# EAGLE schematic SWD_OptoIsolator (EAGLE 7.7.0)
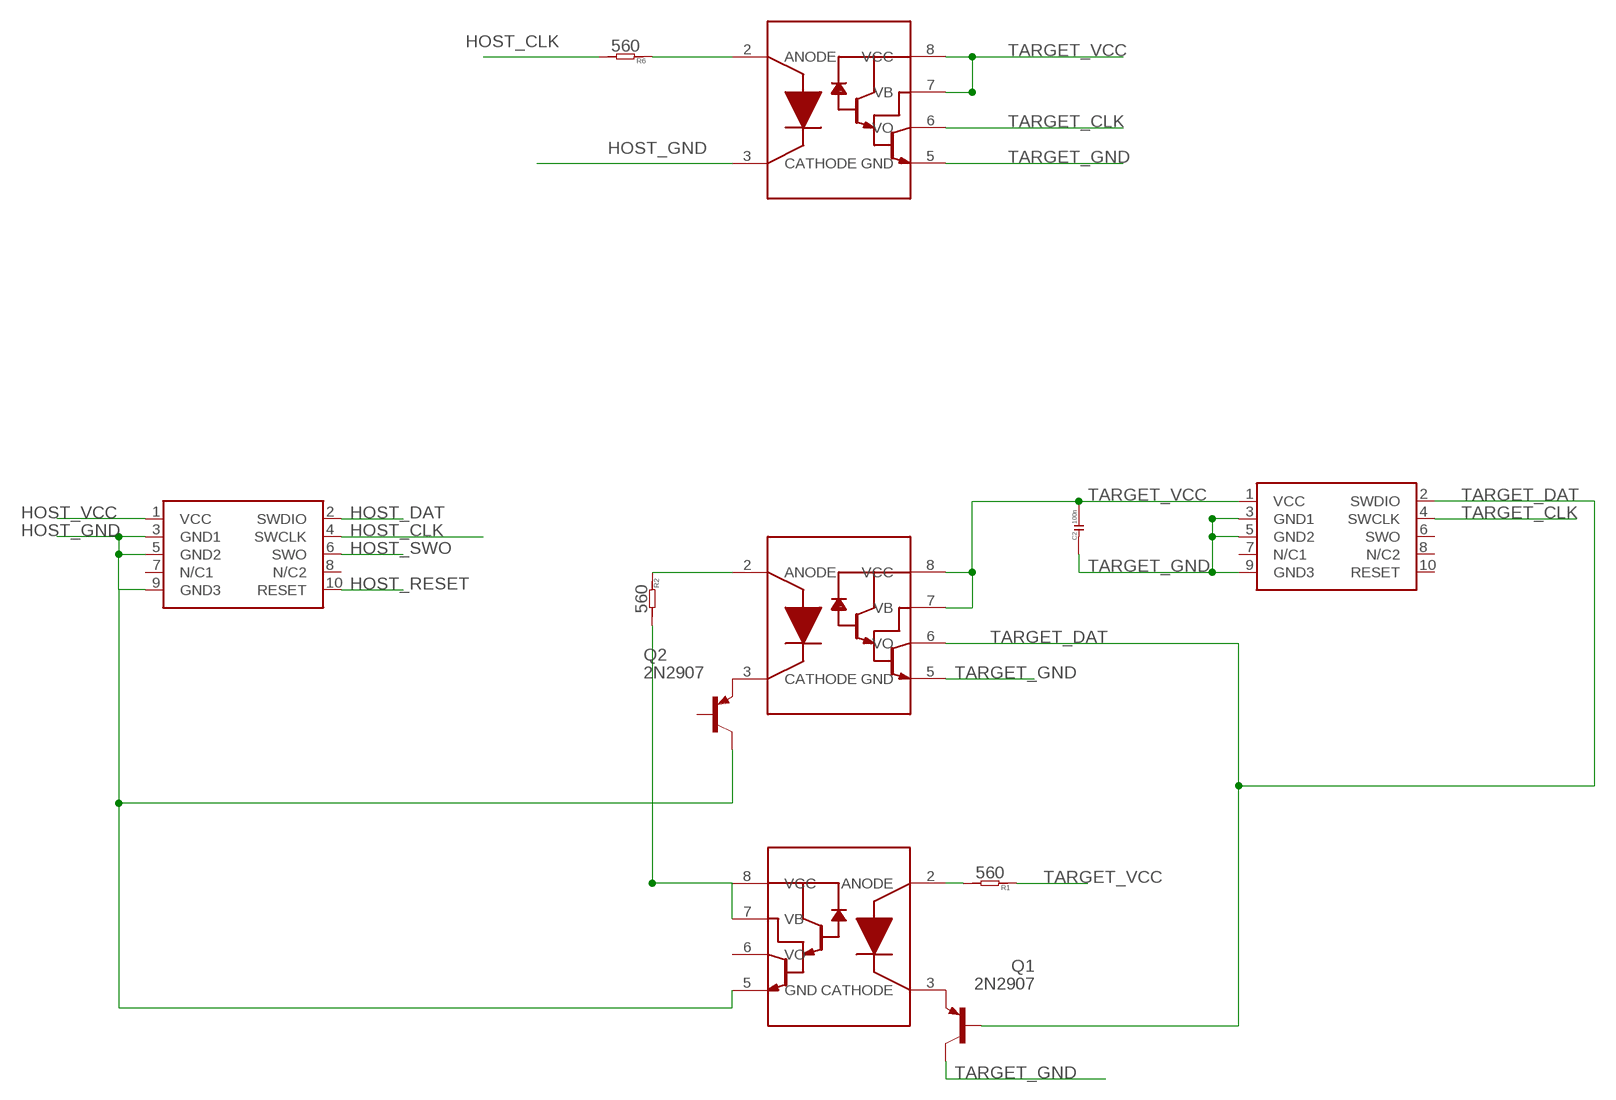
[diagram p0: schematic, sheet 1]

## Parts
C2  100n  C-0603  [C0603]
Q1  2N2907  [TO92-EBC-OVAL]
Q2  2N2907  [TO92-EBC-OVAL]
R1  560  R-0603  [R0603]
R2  560  R-0603  [R0603]
R6  560  R-0603  [R0603]
SWD1  CORTEX_SWD  [M50-3600542]
SWD2  CORTEX_SWD  [M50-3600542]
U$1  6N139S  [8DIPSMD]
U$2  6N139S  [8DIPSMD]
U$20  6N139S  [8DIPSMD]

## Nets
HOST_CLK: R6.2 SWD1.4(SWCLK)
HOST_DAT: SWD1.2(SWDIO)
HOST_GND: Q2.C SWD1.3(GND1) SWD1.5(GND2) SWD1.9(GND3) U$1.5(GND) U$2.3(CATHODE)
HOST_RESET: SWD1.10(RESET)
HOST_SWO: SWD1.6(SWO)
HOST_VCC: SWD1.1(VCC)
N$1: Q1.E U$1.3(CATHODE)
N$2: R2.2 U$1.7(VB) U$1.8(VCC)
N$3: R2.1 U$20.2(ANODE)
N$4: R1.2 U$1.2(ANODE)
N$5: Q2.E U$20.3(CATHODE)
N$8: R6.1 U$2.2(ANODE)
TARGET_CLK: SWD2.4(SWCLK) U$2.6(VO)
TARGET_DAT: Q1.B SWD2.2(SWDIO) U$20.6(VO)
TARGET_GND: C2.1 Q1.C SWD2.3(GND1) SWD2.5(GND2) SWD2.9(GND3) U$2.5(GND) U$20.5(GND)
TARGET_VCC: C2.2 R1.1 SWD2.1(VCC) U$2.7(VB) U$2.8(VCC) U$20.7(VB) U$20.8(VCC)
Unconnected: Q2.B SWD1.7(N/C1) SWD1.8(N/C2) SWD2.6(SWO) SWD2.7(N/C1) SWD2.8(N/C2) SWD2.10(RESET) U$1.6(VO)

## Library data of the parts
C2 = OPL:C*
Q1 Q2 = adafruit:2N2907*: PNP Transistor Big Oval pads
R1 R2 R6 = OPL:R*
SWD1 SWD2 = carrilib with jtags:CORTEX_SWD: .05" Cortex M Connector in SWD mode Manufacturer: Generic Part Number: Cortex M SWD Notes: I use Harwin M50-3600542 connectors; OC_FARNELL: unknown
U$1 U$2 U$20 = FenixBase:6N139S

## Net classes
0 default: width 0.254 mm
1 power: width 0.5 mm
2 mediumpower: width 0.381 mm
3 groundplane: width 0.381 mm